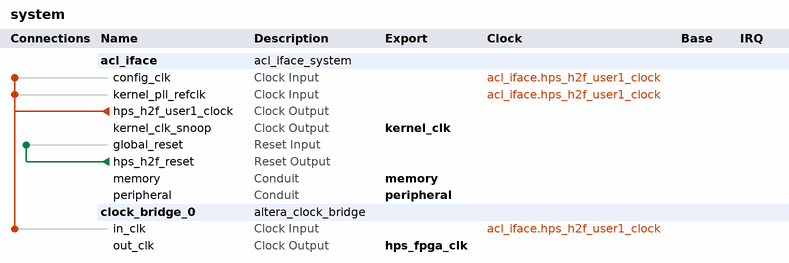
[diagram p0: system contents]
# Platform Designer (Qsys) system system, Cyclone V 5CSEMA4U23C6
# Parameters at their usual value, and those the tool derives, are not listed.
package require -exact qsys 14.1
create_system system
set_project_property DEVICE_FAMILY {Cyclone V}
set_project_property DEVICE 5CSEMA4U23C6

add_instance acl_iface acl_iface_system 1.0

add_instance clock_bridge_0 altera_clock_bridge 14.1
set_instance_parameter_value clock_bridge_0 DERIVED_CLOCK_RATE 50000000
set_instance_parameter_value clock_bridge_0 EXPLICIT_CLOCK_RATE 0

# connections
add_connection acl_iface.hps_h2f_user1_clock acl_iface.config_clk clock
add_connection acl_iface.hps_h2f_user1_clock acl_iface.kernel_pll_refclk clock
add_connection acl_iface.hps_h2f_user1_clock clock_bridge_0.in_clk clock
add_connection acl_iface.hps_h2f_reset acl_iface.global_reset reset

# exported interfaces
add_interface hps_fpga_clk clock source
set_interface_property hps_fpga_clk EXPORT_OF clock_bridge_0.out_clk
add_interface kernel_clk clock source
set_interface_property kernel_clk EXPORT_OF acl_iface.kernel_clk_snoop
add_interface memory conduit end
set_interface_property memory EXPORT_OF acl_iface.memory
add_interface peripheral conduit end
set_interface_property peripheral EXPORT_OF acl_iface.peripheral

set_interconnect_requirement {$system} qsys_mm.clockCrossingAdapter FIFO
set_interconnect_requirement {$system} qsys_mm.maxAdditionalLatency 0

save_system system.qsys
